# EAGLE design leoONE (EAGLE 6.5.0)
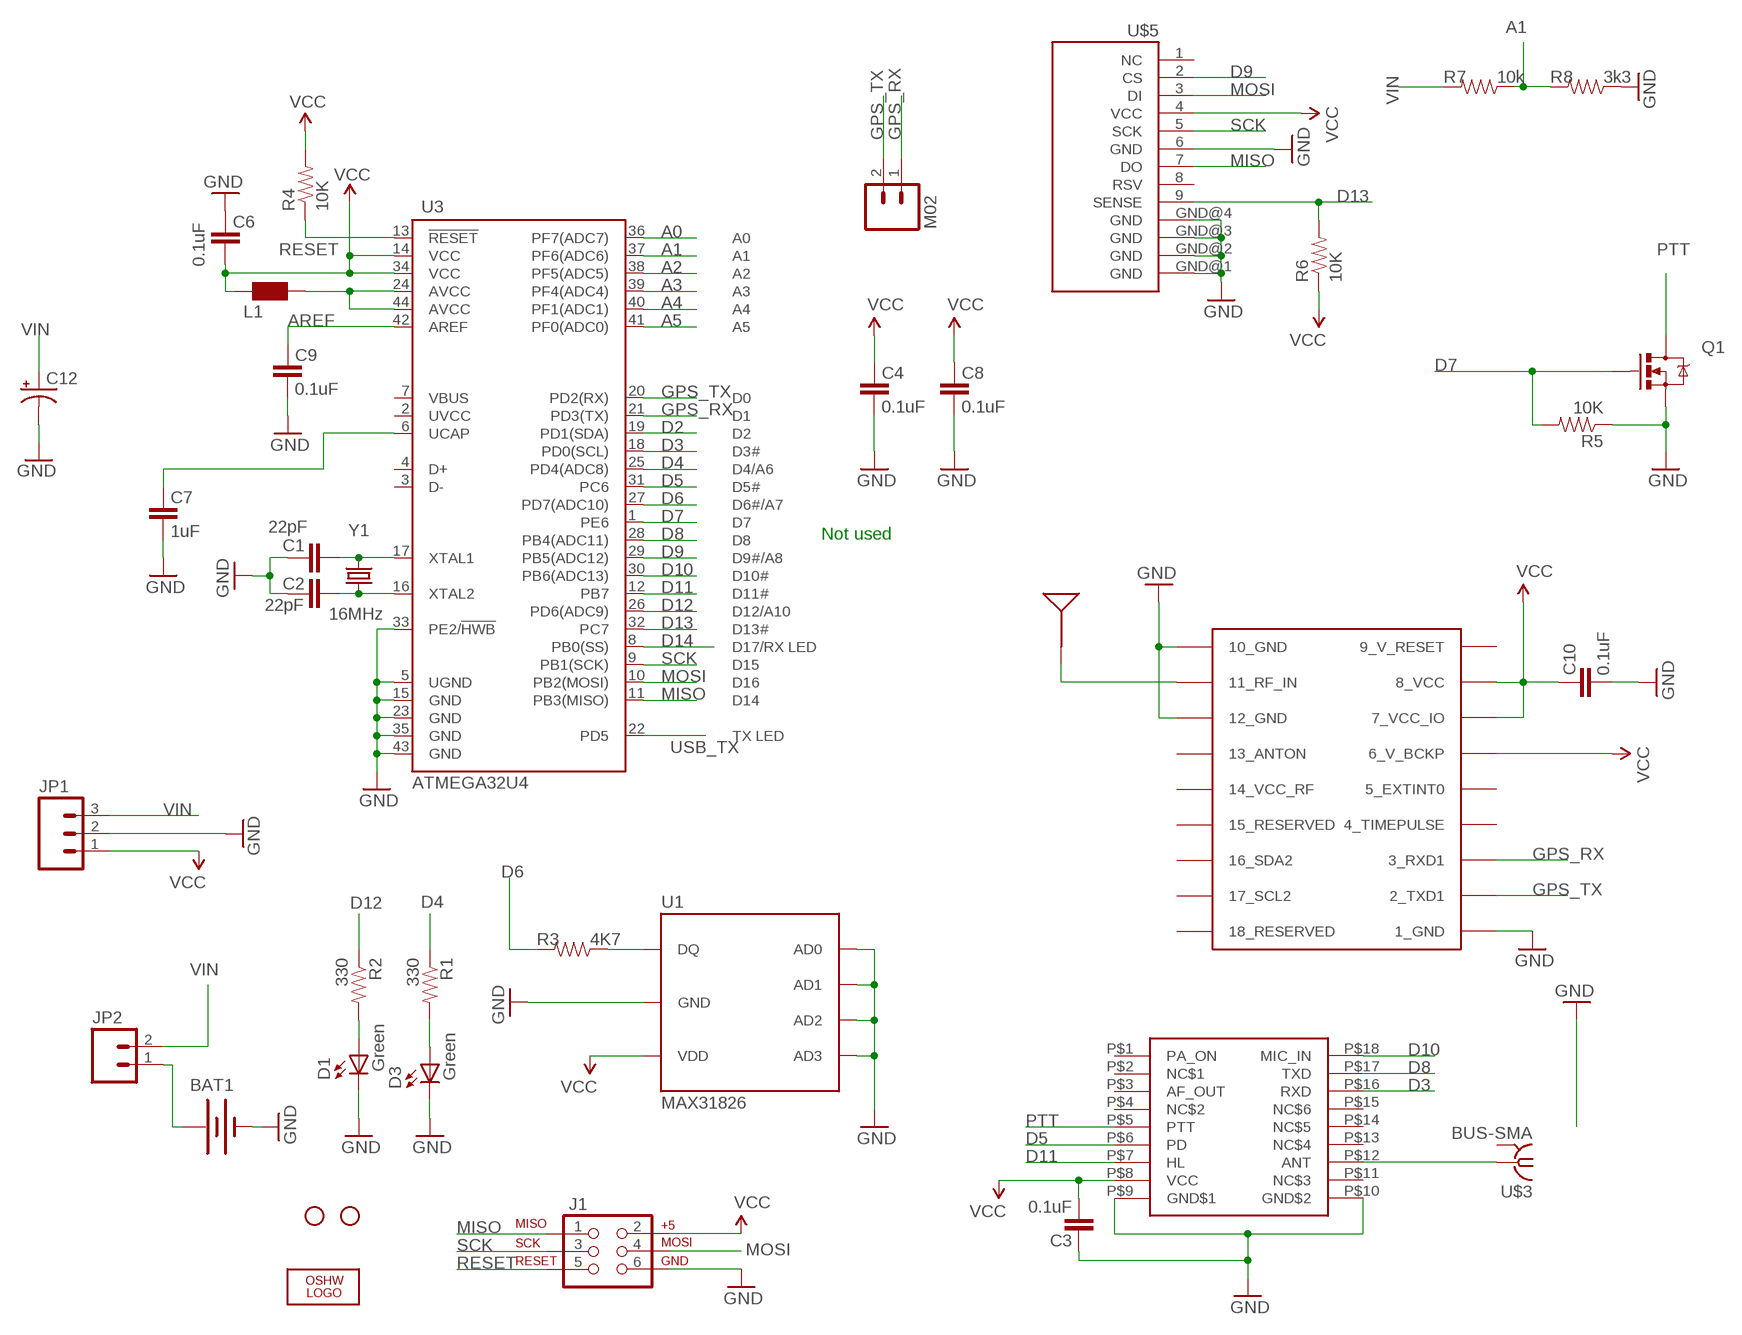
[diagram p0: schematic, sheet 1]

## Parts
BAT1  BATTERYAA  [BATTERY-AA]
C1  22pF  CAP0805  [0805]
C2  22pF  CAP0805  [0805]
C3  0.1uF  CAP0805  [0805]
C4  0.1uF  CAP0402-CAP  [0402-CAP]
C6  0.1uF  CAP0805  [0805]
C7  1uF  CAP0805  [0805]
C8  0.1uF  CAP0402-CAP  [0402-CAP]
C9  0.1uF  CAP0805  [0805]
C10  0.1uF  CAP0805  [0805]
C12  CPOL-US153CLV-0405  [153CLV-0405]
D1  Green  LED0603  [LED-0603]
D3  Green  LED0603  [LED-0603]
J1  AVR_SPI_PRG_6PTH  [2X3]
JP1  M03LOCK  [1X03_LOCK]
JP2  M02LOCK  [1X02_LOCK]
L1  MH2029-300Y  WE-CBF_0805  [0805]
LOGO1  OSHW_LOGO_8MILX0200-NT  [OSHW_8X200_NOTEXT]
Q1  MOSFET-NCHANNELSMD  [SOT23-3]
R1  330  RESISTOR0805-RES  [0805]
R2  330  RESISTOR0805-RES  [0805]
R3  4K7  RESISTOR0805-RES  [0805]
R4  10K  RESISTOR0805-RES  [0805]
R5  10K  RESISTOR0805-RES  [0805]
R6  10K  RESISTOR0805-RES  [0805]
R7  10k  RESISTOR0805-RES  [0805]
R8  3k3  RESISTOR0805-RES  [0805]
STANDOFF1  STAND-OFFTIGHT  [STAND-OFF-TIGHT]
STANDOFF2  STAND-OFFTIGHT  [STAND-OFF-TIGHT]
U1  MAX31826  [UMAX8]
U3  ATMEGA32U4  ATMEGA32U4TQFP  [SPARKFUN-DIGITALIC_TQFP44]
U$1  ANTENNA2SMD6  [ANTENNA-CHIP6]
U$2  UBLOX_MAX  [UBLOX_MAX]
U$3  BUS-SMA  [BUS-SMA]
U$5  MICROSD_PI  [MICROSD_PP]
U$7  SA818  [SA818]
U$8  M02  [M02]
Y1  16MHz  ABRACON_ABM3_CRYSTAL  [ABRACON_ABM3_CRYSTAL]

## Nets
A0: U3.36(PF7(ADC7))
A1: R7.1 R8.2 U3.37(PF6(ADC6))
A2: U3.38(PF5(ADC5))
A3: U3.39(PF4(ADC4))
A4: U3.40(PF1(ADC1))
A5: U3.41(PF0(ADC0))
AREF: C9.2 U3.42(AREF)
D2: U3.19(PD1(SDA))
D3: U3.18(PD0(SCL)) U$7.P$16(RXD)
D4: R1.1 U3.25(PD4(ADC8))
D5: U3.31(PC6) U$7.P$6(PD)
D6: R3.2 U3.27(PD7(ADC10))
D7: Q1.1(G) R5.2 U3.1(PE6)
D8: U3.28(PB4(ADC11)) U$7.P$17(TXD)
D9: U3.29(PB5(ADC12)) U$5.2(CS)
D10: U3.30(PB6(ADC13)) U$7.P$18(MIC_IN)
D11: U3.12(PB7) U$7.P$7(HL)
D12: R2.1 U3.26(PD6(ADC9))
D13: R6.2 U3.32(PC7) U$5.9(SENSE)
D14: U3.8(PB0(SS))
GND [vcc]: BAT1.GND@1(-) C1.2 C2.2 C3.2 C4.1 C6.2 C7.1 C8.1 C9.1 C10.1 C12.- D1.C D3.C J1.6 JP1.2 Q1.2(S) R5.1 R8.1 U1.4(GND) U1.5(AD0) U1.6(AD1) U1.7(AD2) U1.8(AD3) U3.5(UGND) U3.15(GND) U3.23(GND) U3.33(PE2/!HWB) U3.35(GND) U3.43(GND) U$2.1_GND U$2.10_GND U$2.12_GND U$5.6(GND) U$5.GND@1(GND) U$5.GND@2(GND) U$5.GND@3(GND) U$5.GND@4(GND) U$7.P$9(GND$1) U$7.P$10(GND$2)
GPS_RX: U3.21(PD3(TX)) U$2.3_RXD1 U$8.1
GPS_TX: U3.20(PD2(RX)) U$2.2_TXD1 U$8.2
MISO: J1.1 U3.11(PB3(MISO)) U$5.7(DO)
MOSI: J1.4 U3.10(PB2(MOSI)) U$5.3(DI)
N$1: C2.1 U3.16(XTAL2) Y1.P$1
N$2: C1.1 U3.17(XTAL1) Y1.P$2
N$3: R3.1 U1.2(DQ)
N$4: C7.2 U3.6(UCAP)
N$5: D3.A R1.2
N$6: BAT1.PWR@1(+) JP2.1
N$7: D1.A R2.2
N$11: U$1.1(SIGNAL) U$2.11_RF_IN
N$15: L1.2 U3.24(AVCC) U3.44(AVCC)
N$20: U$3.1 U$7.P$12(ANT)
PTT: Q1.3(D) U$7.P$5(PTT)
RESET: J1.5 R4.1 U3.13(!RESET)
SCK: J1.3 U3.9(PB1(SCK)) U$5.5(SCK)
USB_TX: U3.22(PD5)
VCC: C3.1 C4.2 C6.1 C8.2 C10.2 J1.2 JP1.1 L1.1 R4.2 R6.1 U1.1(VDD) U3.14(VCC) U3.34(VCC) U$2.6_V_BCKP U$2.7_VCC_IO U$2.8_VCC U$5.4(VCC) U$7.P$8(VCC)
VIN: C12.+ JP1.3 JP2.2 R7.2
Unconnected: U3.2(UVCC) U3.3(D-) U3.4(D+) U3.7(VBUS) U$2.4_TIMEPULSE U$2.5_EXTINT0 U$2.13_ANTON U$2.14_VCC_RF U$2.15_RESERVED U$2.16_SDA2 U$2.17_SCL2 U$2.18_RESERVED U$5.1(NC) U$5.8(RSV) U$7.P$1(PA_ON) U$7.P$2(NC$1) U$7.P$3(AF_OUT) U$7.P$4(NC$2) U$7.P$11(NC$3) U$7.P$13(NC$4) U$7.P$14(NC$5) U$7.P$15(NC$6)

## Notes on the sheet
- Not used

## Power pins joined to a net without a drawn wire
9_V_RESET: U$2.9_V_RESET
GND: U$3.2(GND) U$3.3(GND) U$3.4(GND) U$3.5(GND)

## Library data of the parts
BAT1 = SparkFun:BATTERY: Battery Holders Various common sizes : AA, AAA, 20mm coin cell and 12mm coin cell.
C1-C3 C6 C7 C9 C10 = SparkFun-Capacitors:CAP: Capacitor Standard 0603 ceramic capacitor, and 0.1" leaded capacitor.
C4 C8 = SparkFun:CAP: Capacitor Standard 0603 ceramic capacitor, and 0.1" leaded capacitor.
C12 = rcl:CPOL-US: POLARIZED CAPACITOR, American symbol
D1 D3 = SparkFun-LED:LED: LEDs Standard schematic elements and footprints for 5mm, 3mm, 1206, and 0603 sized LEDs. 5mm - Spark Fun Electronics SKU : COM-00529 (and others)
J1 = SparkFun-Connectors:AVR_SPI_PRG_6: AVR ISP 6 Pin This is the reduced ISP connector for AVR programming. Common on Arduino. This footprint will take up less PCB space and can be used with a 10-pin to 6-pin adapter such as SKU: BOB-08508
JP1 = SparkFun:M03: Header 3 Standard 3-pin 0.1" header. Use with straight break away headers (SKU : PRT-00116), right angle break away headers (PRT-00553), swiss pins (PRT-00743), machine pins (PRT-00117), and female headers (PRT-00115). Molex polarized connector foot print use with SKU : PRT-08232 with associated crimp pins and housings.
JP2 = SparkFun:M02: Header 2 Standard 2-pin 0.1" header. Use with straight break away headers (SKU : PRT-00116), right angle break away headers (PRT-00553), swiss pins (PRT-00743), machine pins (PRT-00117), and female headers (PRT-00115). Molex polarized connector foot print use with SKU : PRT-08233 with associated crimp pins and housings.
L1 = wuerth-elektronik:WE-CBF: SMD EMI Suppression Ferrite Beads - excellent anti-EMI properties - low DCR - impedances till 3000 ohms - rated current up to 6 A
LOGO1 = ohw-logo:OSHW_LOGO_8MIL
Q1 = SparkFun:MOSFET-NCHANNEL
R1-R8 = SparkFun-Passives:RESISTOR: Resistor Basic schematic elements and footprints for 0603, 1206, and PTH resistors.
STANDOFF1 STANDOFF2 = SparkFun-Electromechanical:STAND-OFF: #4 Stand Off This is the mechanical footprint for a #4 phillips button head screw. Use the keepout ring to avoid running the screw head into surrounding components. SKU : PRT-00447
U1 = zZq:MAX31826: MAX31826 is a fast 1-Wire temperature sensor. Make sure to tie the address pins to VCC or GND, they cannot be left floating.
U3 = SparkFun-DigitalIC:ATMEGA32U4: Atmel 44-pin 8-bit Microcontroller with 32KBytes of ISP Flash and USB Controller ----- Please use the QFN-44-NOPAD_1:1 package for the footprint of all boards using a 32U4. Route traces directly away from the pads as much as possible.; PROD_ID: IC-11161
U$1 = SparkFun-RF:ANTENNA2: Chip antenna Single endded antenna. Common with smaller chip antennas. CHIP4 package is the GPS Chip Antenna SKU: GPS-08418. CHIP5 package is 2.4GHz chip antenna SKU: WRL-00144.
U$2 = Ava:UBLOX_MAX: UBLOX MAX
U$3 = newAva:BUS-SMA
U$5 = MICROSD_PITO:MICROSD_PI
U$7 = nicerf:SA818
U$8 = hackedAva:M02
Y1 = newAva:ABRACON_ABM3_CRYSTAL

## Net classes
0 ten10: width 0.254 mm
1 vcc: width 0.254 mm
2 20: width 0.508 mm

## Board
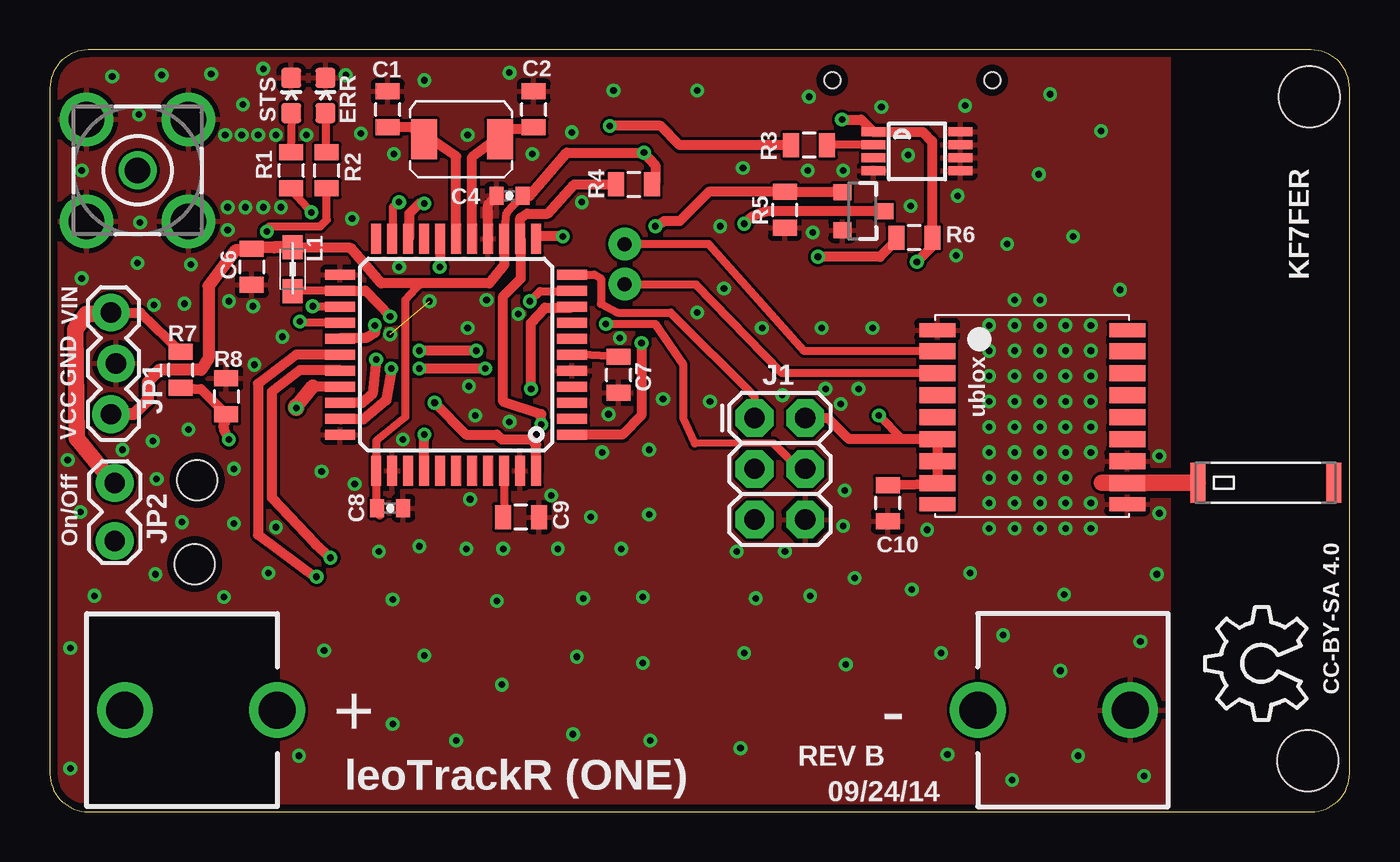
[diagram p1: board, top side]
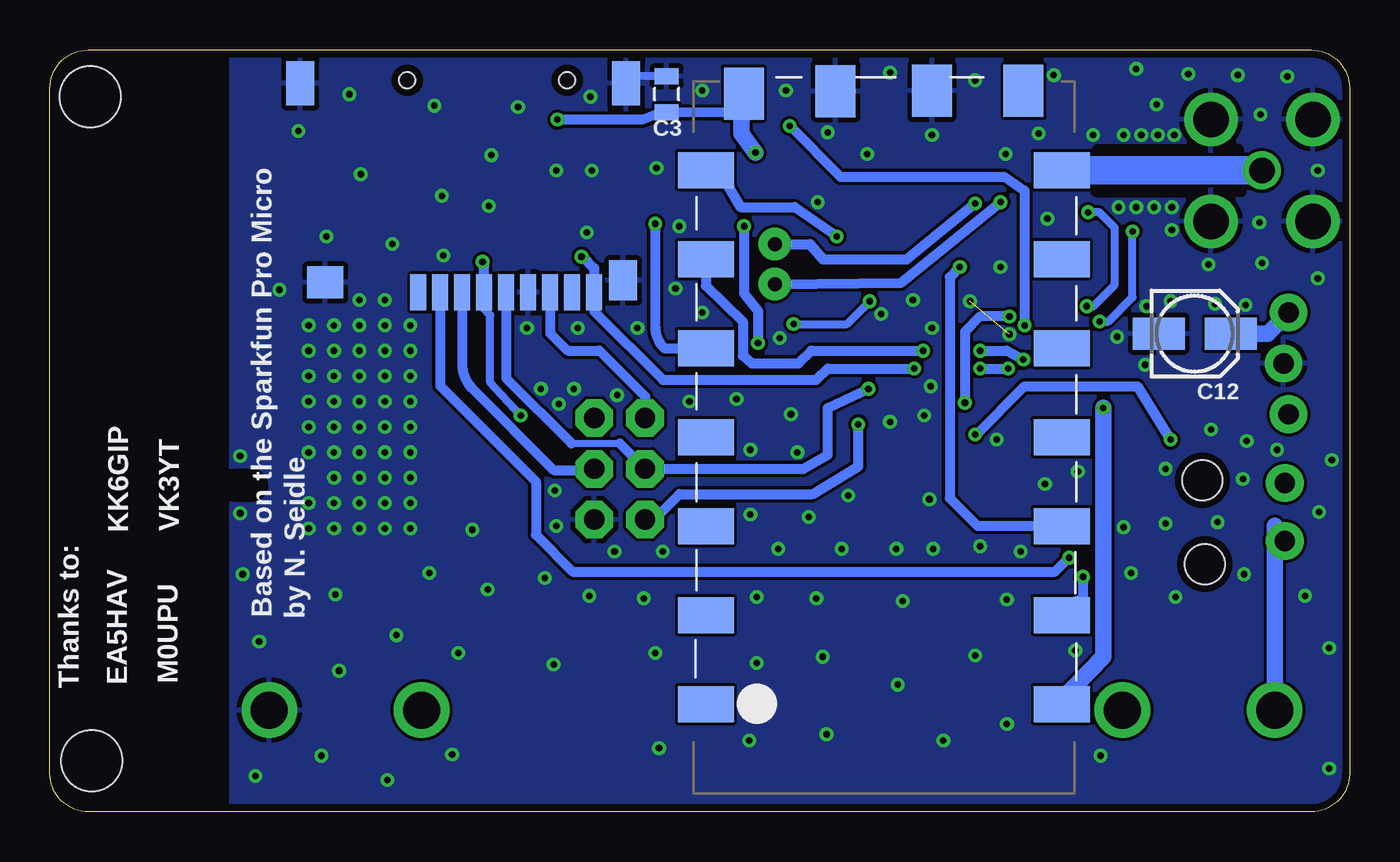
[diagram p2: board, bottom side, seen from below]

Size 65.01 x 38.09 mm. Coordinates in mm from the lower left corner, seen from the top.
Outline: 63.11,38.09 1.9,38.09 arc90 0,36.19 0,1.91 arc90 1.9,0 63.11,0 arc90 65.01,1.91 65.01,36.19 arc90 63.11,38.09
Copper layers (1*16): Top 0.0356mm / dielectric 1.5011mm / Bottom 0.0356mm
Design rules "LaenPCBOrder *": minimum track width 6mil, minimum drill 13mil, track to track 6mil, track to pad 6mil, pad to pad 6mil, via to via 6mil, smd to smd 6mil, copper to edge 15mil, drill to drill 6mil, minimum pad ring 7mil, minimum via ring 7mil, stop-mask expansion 3mil, vias tented up to drill 25mil, thermal gap 10mil
Holes 2 mm at 7.37,16.57 7.24,12.38
tRestrict: 2 lines
bRestrict: 5 lines

### Footprints (pad centres in the part's own frame; a part is rotated, then mirrored left to right if it is on the bottom)
BATTERY-AA = drill 1.854: GND@1 25.146,0; GND@2 17.526,0; PWR@1 -25.146,0; PWR@2 -17.526,0
0805 = smd 0.8 x 1.2: 1 -0.9,0; 2 0.9,0
0402-CAP = smd 0.7 x 0.9: 1 -0.65,0; 2 0.65,0
153CLV-0405 = smd 2.6 x 1.6: + 1.8,0; - -1.8,0
LED-0603 = smd 1 x 1: A 0,-0.877; C 0,0.877
2X3 = drill 1.016 pad 1.88 octagon: 1 0,0; 2 0,2.54; 3 2.54,0; 4 2.54,2.54; 5 5.08,0; 6 5.08,2.54
1X03_LOCK = drill 1.016 pad 1.88: 1 0,0.127; 2 2.54,-0.127; 3 5.08,0.127
1X02_LOCK = drill 1.016 pad 1.88: 1 -0.178,0; 2 2.718,0
0805' = smd 1.2 x 1: 1 -1.1,0; 2 1.1,0
SOT23-3 = smd 0.8 x 0.9: 1 -0.95,-1; 2 0.95,-1; 3 0,1.1
STAND-OFF-TIGHT = hole 3.048: 0,0
UMAX8 = smd 0.45 x 1.2: 1 -0.975,-2.175; 2 -0.325,-2.175; 3 0.325,-2.175; 4 0.975,-2.175; 5 0.975,2.175; 6 0.325,2.175; 7 -0.325,2.175; 8 -0.975,2.175
SPARKFUN-DIGITALIC_TQFP44 = smd 1.5 x 0.5: 1 -5.8,4; 2 -5.8,3.2; 3 -5.8,2.4; 4 -5.8,1.6; 5 -5.8,0.8; 6 -5.8,0; 7 -5.8,-0.8; 8 -5.8,-1.6; 9 -5.8,-2.4; 10 -5.8,-3.2; 11 -5.8,-4; 23 5.8,-4; 24 5.8,-3.2; 25 5.8,-2.4; 26 5.8,-1.6; 27 5.8,-0.8; 28 5.8,0; 29 5.8,0.8; 30 5.8,1.6; 31 5.8,2.4; 32 5.8,3.2; 33 5.8,4 | smd 0.5 x 1.5: 12 -4,-5.8; 13 -3.2,-5.8; 14 -2.4,-5.8; 15 -1.6,-5.8; 16 -0.8,-5.8; 17 0,-5.8; 18 0.8,-5.8; 19 1.6,-5.8; 20 2.4,-5.8; 21 3.2,-5.8; 22 4,-5.8; 34 4,5.8; 35 3.2,5.8; 36 2.4,5.8; 37 1.6,5.8; 38 0.8,5.8; 39 0,5.8; 40 -0.8,5.8; 41 -1.6,5.8; 42 -2.4,5.8; 43 -3.2,5.8; 44 -4,5.8
ANTENNA-CHIP6 = smd 0.75 x 2: 1 -3.4,0; NC 3.4,0
UBLOX_MAX = smd 1.8 x 0.7: 1_GND 4.95,-4.4; 9_V_RESET 4.95,4.3; 10_GND -4.55,4.3; 18_RESERVED -4.55,-4.4 | smd 1.8 x 0.8: 2_TXD1 4.95,-3.35; 3_RXD1 4.95,-2.25; 4_TIMEPULSE 4.95,-1.15; 5_EXTINT0 4.95,-0.05; 6_V_BCKP 4.95,1.05; 7_VCC_IO 4.95,2.15; 8_VCC 4.95,3.25; 11_RF_IN -4.55,3.25; 12_GND -4.55,2.15; 13_ANTON -4.55,1.05; 14_VCC_RF -4.55,-0.05; 15_RESERVED -4.55,-1.15; 16_SDA2 -4.55,-2.25; 17_SCL2 -4.55,-3.35
BUS-SMA = drill 1.27: 1 0,0 | drill 1.778: 2 -2.55,2.55; 3 2.55,2.55; 4 2.55,-2.55; 5 -2.55,-2.55
MICROSD_PP = smd 1.8 x 0.8: 1 0,3.85; 2 0,2.75; 3 0,1.65; 4 0,0.55; 5 0,-0.55; 6 0,-1.65; 7 0,-2.75; 8 0,-3.85; 9 0,-4.95 | smd 1.6 x 1.8: GND@1 0.5,8.5 | smd 2.2 x 1.4: GND@2 10.45,9.75; GND@4 10.45,-6.55 | smd 2 x 1.4: GND@3 0.6,-6.4 | hole 0.8: 10.6,4.4; 10.6,-3.6
SA818 = smd 1.8 x 2.8: P$1 13.35,-9.525; P$2 8.9,-9.525; P$3 4.45,-9.525; P$4 0,-9.525; P$5 -4.45,-9.525; P$6 -8.9,-9.525; P$7 -13.35,-9.525; P$12 -13.35,8.275; P$13 -8.9,8.275; P$14 -4.45,8.275; P$15 0,8.275; P$16 4.45,8.275; P$17 8.9,8.275; P$18 13.35,8.275 | smd 2.6 x 2: P$8 -17.175,-7.625; P$9 -17.3,-3.043; P$10 -17.31,1.778; P$11 -17.31,6.355
M02 = drill 0.7 pad 1.626: 1 0.032,0.08; 2 2.032,0.08
ABRACON_ABM3_CRYSTAL = smd 1.3 x 2: P$1 -3.4,0.1; P$2 0.4,0.1

### Placement (x,y rotation side)
BAT1  28.89,5.08 0 top
C1  16.89,35.12 90 top
C2  24.19,35.12 90 top
C3  34.16,35.88 90 bottom
C4  22.99,30.8 0 top
C6  10.1,27.24 270 top
C7  28.45,21.84 90 top
C8  17.02,15.18 180 top
C9  23.56,14.73 180 top
C10  41.91,15.43 90 top
C12  7.75,23.91 0 bottom
D1  13.78,35.81 0 top
D3  12.06,35.81 0 top
J1  35.24,19.68 270 top
JP1  3.17,19.88 90 top
JP2  3.24,13.72 90 top
L1  MH2029-300Y  [0805']  12.13,27.11 270 top
LOGO1  62.86,4.57 90 top
Q1  40.64,30.04 270 top
R1  12.06,32.07 90 top
R2  13.84,32.07 90 top
R3  37.97,33.34 180 top
R4  29.21,31.37 0 top
R5  36.77,30.1 90 top
R6  43.24,28.7 180 top
R7  6.54,22.1 90 top
R8  8.83,20.76 270 top
STANDOFF1  62.99,35.75 0 top
STANDOFF2  62.93,2.54 0 top
U1  43.37,33.02 270 top
U3  20.32,22.86 180 top
U$1  60.83,16.45 0 top
U$2  49.34,19.68 180 top
U$3  4.38,32.07 0 top
U$5  42.74,25.97 90 bottom
U$7  22.67,18.73 270 bottom
U$8  28.83,26.35 90 top
Y1  19.11,33.72 180 top

### Tracks (layer width: path | path; a pad name or v marks a point on that pad's centre or on a via)
A1  (via drill 0.33)
  Top 0.508: U3.37 18.72,18.85 v18.73,18.86 | v8.95,18.61 8.7,19.18 8.72,19.5 8.64,19.75 | R7.1 7.56,21.13 R8.2
  Top 0.61: R8.2 8.71,19.75 8.72,19.5
  Bottom 0.508: v18.73,18.86 18.67,18.86 16.26,21.27 10.6,21.27 v8.95,18.61
AREF
  Top 0.406: U3.42 22.72,15.73 22.73,15.05 22.73,14.55 C9.2
D3  (via drill 0.33)
  Top 0.508: U3.18 19.52,27.52 v19.49,27.24
  Bottom 0.508: U$7.P$16 18.61,14.29 20,15.68 20,26.73 v19.49,27.24
D4  (via drill 0.33)
  Top 0.406: U3.25 13.16,25.26 v13.14,25.27 | v13.08,29.97 12.19,30.99 R1.1
  Bottom 0.406: v13.14,25.27 12.83,25.27 11.75,26.35 11.75,29.21 12.51,29.97 v13.08,29.97
D5  (via drill 0.33)
  Top 0.508: v21.34,23.05 v18.48,23.05 | v16.32,22.61 16.13,20.89 15.62,20.45 14.53,20.45 U3.31
  Bottom 0.508: U$7.P$6 32.19,26.29 30.35,24.51 30.35,22.8 29.91,22.42 27.56,22.42 26.92,23.05 v21.34,23.05 | v18.48,23.05 17.14,23.05 v16.32,22.61
D6  (via drill 0.33)
  Top 0.508: R3.2 31.5,33.34 30.54,34.29 v28,34.29 | v16.26,24.32 16.26,23.94 15.81,23.69 14.55,23.69 U3.27
  Bottom 0.508: v28,34.29 25.46,31.75 17.27,31.75 16.26,31.05 v16.26,24.32
D7  (via drill 0.33)
  Top 0.508: Q1.1 arc45 39.16,31 R5.2 32.97,31 31.5,29.53 30.73,29.53 v30.29,29.27 | v29.59,23.43 29.59,19.81 28.64,18.86 U3.1
  Bottom 0.508: v30.29,29.27 30.29,25.91 29.59,25.02 v29.59,23.43
D8  (via drill 0.33)
  Top 0.508: U3.28 12.32,22.86 10.41,21.4 10.41,13.84 13.33,11.68 v13.33,11.75
  Bottom 0.508: v13.33,11.75 13.33,10.67 14.92,10.03 15.11,9.84 14.4,9.84 U$7.P$17
D9  (via drill 0.33)
  Top 0.508: v14.03,12.7 13.27,13.4 11.11,15.68 11.11,21.02 12.51,22.1 14.48,22.1 U3.29
  Bottom 0.508: U$5.2 45.49,21.29 40.7,16.51 40.7,13.84 38.86,12 14.73,12 v14.03,12.7
D10  (via drill 0.33)
  Top 0.508: 13.14,21.27 14.34,21.27 U3.30
  Top 0.711: 12.32,20.26 13.14,21.27
  Top 0.813: v12.32,20.19 12.32,20.26
  Bottom 0.813: U$7.P$18 14.39,5.61 12.32,7.75 v12.32,20.19
D11  (via drill 0.33)
  Top 0.508: v25.65,28.77 24.43,28.77 U3.12
  Bottom 0.508: U$7.P$7 31.57,32.08 30.48,30.23 27.75,30.23 v25.65,28.77
D12  (via drill 0.33)
  Top 0.406: U3.26 12.56,24.46 v12.51,24.51 | v10.86,29.02 10.86,29.15 10.99,29.27 13.53,29.27 13.84,29.59 R2.1
  Bottom 0.406: v12.51,24.51 12.07,24.51 10.86,25.72 v10.86,29.02
D13  (via drill 0.33)
  Top 0.508: R6.2 42.34,28.56 41.53,27.75 v38.42,27.75 | v21.78,22.16 v18.48,22.16 | v17.08,22.16 16.83,20.57 15.68,19.62 14.55,19.62 U3.32
  Bottom 0.508: v38.42,27.75 38.35,27.75 37.78,27.18 U$5.9 | U$5.9 | U$5.9 37.78,25.02 34.35,21.59 26.67,21.59 26.1,22.16 v21.78,22.16 | v18.48,22.16 v17.08,22.16
GND  (via drill 0.33)  (1 unrouted)
  Top 0.508: U3.15 21.92,30.38 C4.1
  Bottom 0.406: C3.2 36.19,36.78 U$5.GND@4
  other vias: 24.13,32.89 27.94,19.88 33.02,20.51 33.72,26.16 11.3,14.22 32.38,24.96 23.43,24.89 17.46,27.24 20.89,24.19 21.84,25.59 52.07,24.32 52.07,23.05 52.07,21.78 52.07,20.51 52.07,19.24 52.07,17.97 50.8,17.97 50.8,19.24 50.8,20.51 49.53,21.78 50.8,23.05 50.8,24.32 49.53,24.32 49.53,23.05 50.8,21.78 49.53,20.51 49.53,19.24 49.53,17.97 48.26,17.97 46.99,17.97 46.99,19.24 48.26,19.24 48.26,20.51 48.26,21.78 48.26,23.05 48.26,24.32 46.99,24.32 46.99,23.05 46.99,21.78 46.99,20.51 46.99,16.7 48.26,16.7 49.53,16.7 50.8,16.7 50.8,15.43 49.53,15.43 48.26,15.43 46.99,15.43 49.53,25.59 48.26,25.59 55.5,14.92 55.5,17.78 50.8,14.16 52.07,15.43 49.53,14.16 48.26,14.16 46.99,14.16 52.07,14.16 39.81,7.37 43.88,14.1 43.12,11.11 39.75,16.07 39.69,14.29 39.56,20.38 40.45,21.15 38.8,21.15 36.64,20.83 30.67,20.64 29.97,18.1 29.97,14.86 27.05,14.73 25.08,15.81 25.4,13.14 28.58,13.14 34.35,13.02 36.77,13.02 40.26,11.68 38.04,10.79 35.31,10.67 29.65,10.73 26.67,10.67 22.67,13.14 20.83,13.14 21.02,15.62 18.48,13.27 16.45,13.02 15.24,16.38 13.59,17.02 10.92,11.94 13.72,8.06 8.7,10.73 9.21,17.14 5.21,25.34 6.73,25.4 18.99,25.53 20.96,21.27 22.99,19.49 21.27,19.81 17.65,18.61 33.53,29.27 34.67,32.19 39.69,32.07 38.16,28.96 45.34,27.81 45.4,30.8 53.53,26.1 45.78,35.31 41.59,35.24 42.93,32.83 43.05,30.29 37.97,35.75 32.38,36.07 28.19,36.07 26.1,33.97 18.73,36.58 15.11,29.65 10.67,30.23 10.67,37.15 6.92,19.11 10.16,25.27 10.22,22.35 9.21,14.41 5.27,11.87 3.62,18.1 1.52,14.99 1.59,26.67 7.05,27.37 4.51,29.46 1.59,32.07 4.45,34.86 8.06,36.89 34.54,3.17 34.73,7.94 44.58,7.94 55.37,11.87 54.55,8.51 54.74,1.78 48.13,1.59 51.43,2.79 47.69,8.83 44.89,2.86 30.04,3.56 12.45,2.79 2.22,10.79 5.33,16.64 17.14,10.6 22.35,10.54 17.14,4.38 29.65,7.43 22.61,6.35 8.89,30.23 9.78,30.23 11.56,30.23 12.83,33.85 10.41,33.85 9.59,33.85 8.76,33.85 11.3,33.85 8.95,25.53 4.38,27.43 5.59,36.83 3.11,36.77 46.04,11.94 51.18,28.77 52.58,34.04 50.04,35.88 47.88,28.38 20.89,33.85 17.21,32.89 14.8,36.83 15.56,33.91 41.15,24.19 38.61,24.19 35.62,24.19 27.62,17.97 6.6,14.48 11.62,23.75 26.61,30.48 37.91,32.07 9.65,35.37 8.89,29.08 49.47,31.88 18.73,7.81 26.16,3.87 20.32,3.56 26.35,7.75 1.02,2.16 1.02,8.19 50.74,10.86 50.55,7.05 22.99,36.96 17.02,23.88 28.51,23.69 0.89,17.59 5.14,18.54
  pour Top: 0.06,38.1 55.94,38.1 55.94,0 0.06,0
  pour Bottom: 0.06,38.1 55.94,38.1 55.94,0 0.06,0
GPS_RX  (via drill 0.33)
  Top 0.406: U$2.3_RXD1 36.61,21.93 32.32,26.35 28.78,26.35 U$8.1 | v17.46,30.48 17.34,30.35 17.14,30.23 17.14,28.75 U3.21
  Bottom 0.508: U$8.1 22.45,26.45 v17.46,30.48
GPS_TX  (via drill 0.33)
  Top 0.406: U$2.2_TXD1 37.73,23.04 32.96,28.38 U$8.2
  Top 0.508: v18.73,30.42 18.48,30.42 17.97,29.91 17.97,28.71 U3.20
  Bottom 0.508: U$8.2 26.99,28.38 26.35,27.62 22.16,27.62 v18.73,30.42
MISO
  Top 0.406: U3.11 27.24,26.86 27.56,26.67 27.56,25.4 28.38,24.96 31.05,24.96 35.24,20.77 J1.1
  Bottom 0.508: U$5.7 39.99,23.92 39.12,23.05 37.53,23.05 35.24,20.77 J1.1
MOSI  (via drill 0.33)
  Top 0.356: 36.2,18.41 32.26,18.41
  Top 0.406: J1.4 37.46,17.14 36.2,18.41 | 32.26,18.41 31.69,19.68 31.69,22.35 30.29,24.38 v27.81,24.38 | v24,25.53 24.51,26.04 26.1,26.04 U3.10
  Bottom 0.406: v27.81,24.38 25.15,24.38 v24,25.53
  Bottom 0.508: U$5.3 44.39,22.57 arc-45 43.95,21.22 39.81,17.08 37.94,17.08 arc-45 J1.4
N$1
  Top 0.508: U3.16 21.12,32.74 22.16,33.53 22.42,33.53 Y1.P$1 22.51,33.88 22.8,34.16 24.14,34.16 C2.1
N$2
  Top 0.508: U3.17 20.32,32.77 19.11,33.59 18.74,33.59 Y1.P$2 18.1,34.23 C1.1
N$3
  Top 0.406: U1.2 38.89,33.34
  Top 0.508: 38.89,33.34 arc45 R3.1
N$4
  Top 0.406: C7.2 U3.6
N$5
  Top 0.406: R1.2 12.11,34.81 D3.A
N$6
  Bottom 0.813: BAT1.PWR@1 3.75,14.3 JP2.1
N$7
  Top 0.406: D1.A 13.78,33.03
  Top 0.61: 13.78,33.03 R2.2
N$11
  Top 0.813: U$1.1 52.63,16.45 U$2.11_RF_IN
N$15  (via drill 0.33)
  Top 0.406: U3.24 12.17,26.06 L1.2
  Top 0.508: U3.24 15.79,26.06 v17.02,24.77 | U3.44 24.32,18.35 24.07,18.61 22.61,18.61 22.35,18.86 20.83,18.86 v19.24,20.45
  Bottom 0.508: v17.02,24.77 18.48,24.77 19.24,24 v19.24,20.45
N$20
  Bottom 1.422: U$7.P$12 4.4,32.08 U$3.1
PTT  (via drill 0.33)
  Top 0.508: Q1.3 36.16,30.04 arc45 34.81,29.48 v34.73,29.4
  Bottom 0.508: v34.73,29.4 34.73,24.25 arc-45 34.29,23.18 32.21,23.18 arc-45 U$7.P$5
RESET  (via drill 0.33)
  Top 0.508: R4.1 26.23,31.37 24.89,29.91 23.88,29.91 23.52,29.68 U3.13 23.56,28.62 23.56,26.67 22.67,25.78 22.67,20.51 24.57,19.88 v24.57,19.37
  Bottom 0.508: J1.5 34.8,14.61 33.53,15.88 26.86,15.88 24.57,17.27 v24.57,19.37
SCK  (via drill 0.33)
  Top 0.508: 26.1,25.24 U3.9 26.07,25.21 24.76,25.21 24.07,24.45 v24.07,21.14
  Bottom 0.356: 38.93,18.41 36.51,18.41
  Bottom 0.508: U$5.5 42.19,21.68 38.93,18.41 | 36.51,18.41 J1.3 27.3,17.14 26.1,17.84 26.1,20.19 v24.07,21.14
VCC  (via drill 0.33)
  Top 0.406: U3.14 22.85,29.94 C4.2 | C8.2 16.51,14.81 16.38,14.92 16.32,15.24 U3.34 16.32,18.54 17.78,19.75 17.78,25.59 18.54,26.42 | 42.64,18.64 v41.47,19.81 | U$2.8_VCC 44.65,16.43 44.71,16.38
  Top 0.508: U3.14 22.72,27.36 21.97,26.42 18.54,26.42 16.57,26.42 15.05,28.19 12.15,28.19 L1.1 | J1.2 38.93,19.68 39.98,18.64 42.64,18.64 U$2.6_V_BCKP U$2.7_VCC_IO U$2.8_VCC | 44.71,16.38 C10.2 | v43.37,27.5 44.07,28.19 44.07,28.77 arc-45 R6.1 44.13,28.9 44.13,33.53 43.67,33.99 U1.1 40.58,34.61 v39.62,34.61 | C4.2 24,30.8 25.84,32.96 v29.72,32.96 30.29,32.32 30.29,31.44 R4.2
  Top 0.61: L1.1 11.22,28.21 10.03,28.19 9.85,28.13 | 9.85,28.13 C6.1 | 9.85,28.13 9.27,28.07 7.94,26.29 7.94,22.67 7.56,22.1 5.46,22.1 4.89,21.46 4.89,20.57 4.19,19.88 JP1.1
  Bottom 0.406: v41.47,19.81 42.99,21.46 42.99,24.83 43.31,25.15 43.31,25.95 U$5.4
  Bottom 0.508: U$5.4 43.29,27.29 arc-45 v43.37,27.5 | U$7.P$8 29.67,34.95 C3.1 34.34,35 35.37,34.61 v39.62,34.61
  Bottom 0.813: v29.72,32.96 30.42,33.91 30.42,35.78 U$7.P$8
VIN
  Top 0.508: JP1.3 4.52,24.96 R7.2
  Top 0.813: JP2.2 3.19,16.43 1.33,18.67 1.27,24.13 1.84,24.89 2.86,24.89 JP1.3
  Bottom 0.813: C12.+ 4.09,23.91 JP1.3

### Text on the board
tPlace: STS | ERR | KF7FER | VIN | GND | VCC | On/Off | CC-BY-SA 4.0 | REV B | 09/24/14 | leoTrackR (ONE)
bPlace: VK3YT | KK6GIP | by N. Seidle | Based on the Sparkfun Pro Micro | M0UPU | EA5HAV | Thanks to: